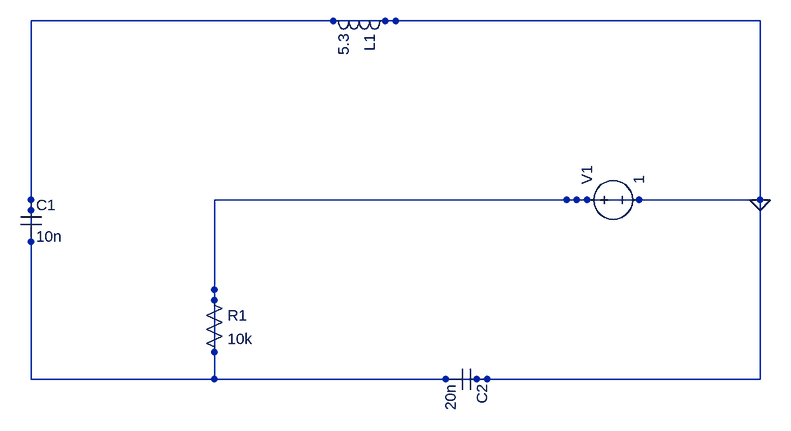
[diagram p0: schematic net2.asc]
net2.asc, the LTspice schematic file:
Version 4
SHEET 1 680 480
SYMBOL voltage 1098 534 R270
SYMATTR InstName V1
SYMATTR Value 1
FLAG 1380 534 0
SYMBOL res 524 672 R0
SYMATTR InstName R1
SYMATTR Value 10k
SYMBOL cap 242 534 R0
SYMATTR InstName C1
SYMATTR Value 10n
SYMBOL ind 819 242 R90
SYMATTR InstName L1
SYMATTR Value 5.3
SYMBOL cap 960 794 R90
SYMATTR InstName C2
SYMATTR Value 20n
WIRE 819 534 1098 534
WIRE 1380 534 1082 534
WIRE 540 810 540 672
WIRE 258 258 258 550
WIRE 819 258 258 258
WIRE 960 810 540 810
WIRE 540 534 819 534
WIRE 540 534 540 688
WIRE 258 810 540 810
WIRE 258 810 258 534
WIRE 1380 258 1380 534
WIRE 1380 258 803 258
WIRE 1380 810 1380 534
WIRE 1380 810 944 810

The netlist it stands for:
* net2.asc
V1 0 0 1
R1 0 0 10k
C1 0 0 10n
L1 0 0 5.3
C2 0 0 20n
.backanno
.end